# EAGLE schematic main controler (EAGLE 8.4.3)
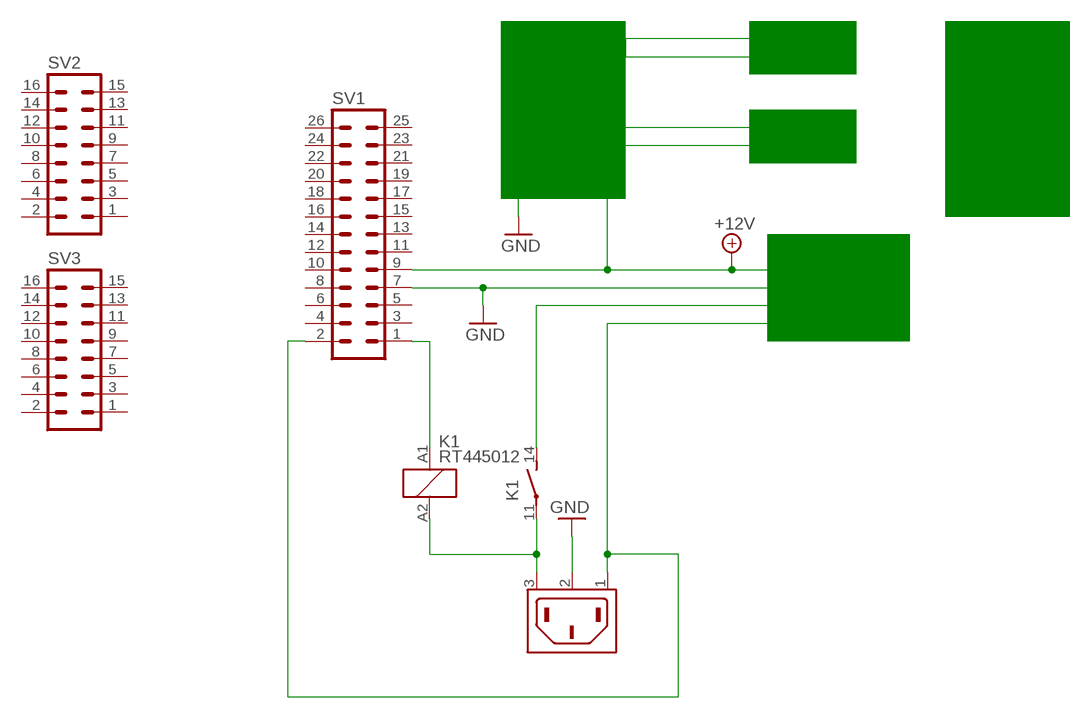
[diagram p0: schematic, sheet 1]

## Parts
K1  RT445012  [RT2N/O]
SV1  MA13-2  [MA13-2]
SV2  MA08-2  [MA08-2]
SV3  MA08-2  [MA08-2]
X1  6ESRM-P  [6ESRM-P]

## Nets
+12V: SV1.9
GND: SV1.7 X1.2(SH)
N$1: K1.11(2:P) K1.A2 X1.3(AC2)
N$2: K1.A1 SV1.1
N$3: K1.14(2:S)
N$4: SV1.2 X1.1(AC1)
Unconnected: K1.21(3:P) K1.24(3:S) SV1.3 SV1.4 SV1.5 SV1.6 SV1.8 SV1.10 SV1.11 SV1.12 SV1.13 SV1.14 SV1.15 SV1.16 SV1.17 SV1.18 SV1.19 SV1.20 SV1.21 SV1.22 SV1.23 SV1.24 SV1.25 SV1.26 SV2.1 SV2.2 SV2.3 SV2.4 SV2.5 SV2.6 SV2.7 SV2.8 SV2.9 SV2.10 SV2.11 SV2.12 SV2.13 SV2.14 SV2.15 SV2.16 SV3.1 SV3.2 SV3.3 SV3.4 SV3.5 SV3.6 SV3.7 SV3.8 SV3.9 SV3.10 SV3.11 SV3.12 SV3.13 SV3.14 SV3.15 SV3.16

## Notes on the sheet
- C3 | C3 | C3 | C3 | C3 | C3 | C3 | C3

## Library data of the parts
K1 = relay:RT44?*: Power PCB Relay SCHRACK 2 pole 8 A, DC and AC-coil Source: http://www.schrack.com/.. 5842.pdf; OC_FARNELL: unknown; OC_NEWARK: unknown
SV1 = con-lstb:MA13-2: PIN HEADER; OC_FARNELL: unknown; OC_NEWARK: unknown
SV2 SV3 = con-lstb:MA08-2: PIN HEADER; OC_FARNELL: unknown; OC_NEWARK: unknown
X1 = con-tycoelectronics:6ESRM-P: AC Connector 120/250 VAC Source: http://catalog.tycoelectronics.com .. ENG_DS_1654001_1099_SR_0406.pdf; MF: TYCO ELECTRONICS; MPN: 6ESRM-P; OC_FARNELL: unknown; OC_NEWARK: 87F1821